# Altium schematic sheet LDR controlled LED.SchDoc
size A; SheetNumber: 1; SheetTotal: 1
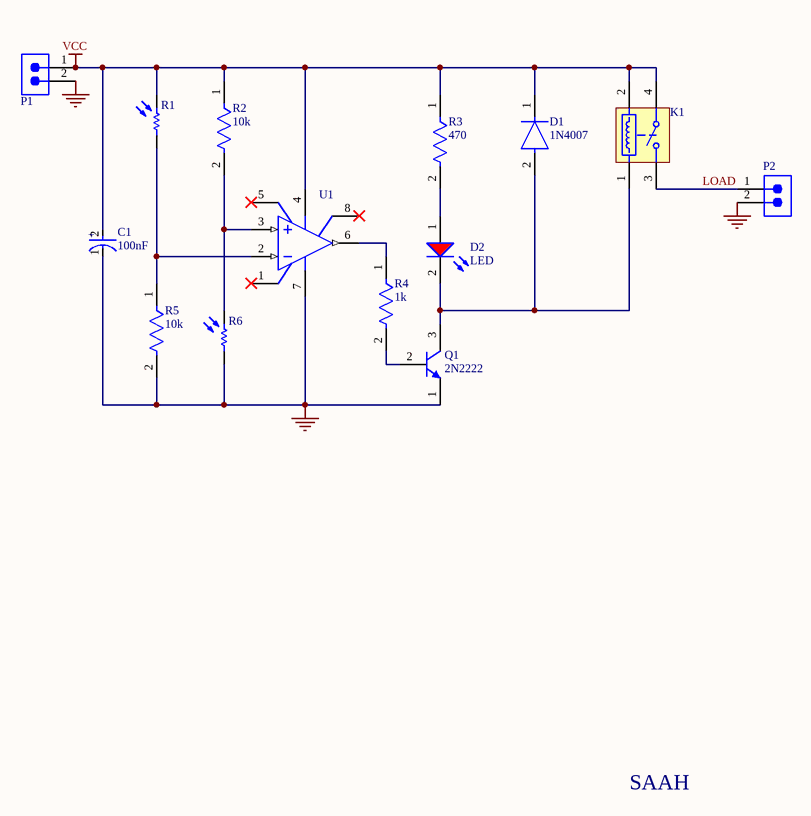
[diagram p0: LDR controlled LED.SchDoc]

## Parts
C1  100nF  [FP-RAD-TH-D_12_5_0_5-L_20-MFG]
D1  1N4007  [FP-1N4007-MFG]
D2  LED  [WL-TMRC_D5.9H8.7]
K1  ALFG1PF09  [PNSC-LF-G-4-3010x1570x2330_V]  (value not drawn)
P1  653102124022  [653102124022]  (value not drawn)
P2  653102124022  [653102124022]  (value not drawn)
Q1  2N2222  [MLTC-TO-18-3]
R1  VT90N1  [EXCE-VT90N1]  (value not drawn)
R2  10k  [FP-CF14-MFG]
R3  470  [FP-CF14-MFG]
R4  1k  [FP-CF14-MFG]
R5  10k  [FP-CF14-MFG]
R6  VT90N1  [EXCE-VT90N1]  (value not drawn)
U1  LM741CN/NOPB  [P0008A]  (value not drawn)

## Nets
GND: C1.1(C) P1.2 P2.2 Q1.1(E) R5.2 R6.1 U1.7(V+)
VCC: C1.2(A) D1.1(C) K1.2 K1.4(COM) P1.1 R1.2 R2.1 R3.1 U1.4(V-)
LOAD: K1.3(NO) P2.1
NetD1_2: D1.2(A) D2.2(K) K1.1 Q1.3(C)
NetD2_1: D2.1(A) R3.2
NetQ1_2: Q1.2(B) R4.2
NetR1_1: R1.1 R5.1 U1.2(IN-)
NetR2_2: R2.2 R6.2 U1.3(IN+)
NetR4_1: R4.1 U1.6(OUT)

Not connected (* = marked no-connect by the designer): U1 1(OFS_NULL)* 5(OFS_NULL)* 8(NC)*

## Notes on the sheet
- SAAH
- (in symbol CMP-05427-000380-1) +

## Library data of the parts
C1 = CMP-05427-000380-1: Aluminum Electrolytic Capacitors (Radial Lead Type) 10uF ±20% 450V; Life (Hours): 10000Hour; Lead Diameter: 0.6mm; Leakage Current: 280uA; Dissipation Factor: 0.24%; Ripple Current: 490mA; Lead Pitch: 5mm; Packaging: Bulk; Min Operating Temperature: -25°C; Package Quantity: 200; Case/Package: Radial; Height - Seated (Max): 0.787inch; Max Operating Temperature: 105°C; Radiation Hardening: No; Lead Free: Lead Free; Series: EE; Capacitance: 10uF; Diameter: 12.5mm; Tolerance: 20%; Termination: Radial; RoHS Compliant: Yes; Voltage Rating: 450V; REACH SVHC: No SVHC; Voltage Rating (DC): 450V; Height: 20mm; Construction: RADIAL; Voltage: 450V; Length: 20mm; Mount: Through Hole
D1 = CMP-123542-000001-1: Rectifier diode 1000 V 1 A DO-41, ,; Manufacturer: Diotec; Max Surge Forward Current: 27A; Forward Current: 1A; Max Junction Temp: +175°C; Reverse Voltage: 1000V; Value: 15pF; Peak Reverse Current: 5uA; Category: Diode; Temperature Range Low: -50°C; Automotive: No; Temperature: -50°C to +175°C; Lead Free: Yes; ComponentLink2Description: Datasheet; Max Repetitive Reverse Voltage: 1000V; ComponentLink2URL: https://datasheet.octopart.com/1N4007-Diotec-datasheet-62346875.pdf; Manufacturer Part Number: 1N4007; Device Class L3: Rectifier Diodes; Height: 2.8mm; Octopart: https://octopart.com/1n4007-diotec-4040411; Package: 1N4007; Temperature Range High: +175°C; Device Class L1: Discrete Semiconductors; Device Class L2: Diodes; RoHS: TRUE; Capacitance: 15pF; Ipc Land Pattern Name: DIOAD888W100L520D280
D2 = CMP-03913-71241449-1: 151051SS04000 WL-TMRC THT Mono-color Round Color; Viewing Angle: 40°; Dominant Wavelength: 635nm; Forward Current: 100mA; Forward Voltage: 2.1V; Luminous Intensity: 250mcd; Max Reverse Voltage (DC): 5V; Peak Wavelength: 640nm; Height: 8.6mm; Packaging: Bulk; Mount: Through Hole; Width: 5mm; Min Operating Temperature: -40°C; Wavelength: 635nm; Max Operating Temperature: 85°C; RoHS: Compliant; Length: 5mm; NexarPartId: 71241449
K1 = CMP-1503-00183-1: LF-G Relays, 9 V Coil Voltage, 1400 mW Nominal Operating Power, -40 to 85 degC, 4-Pin LF-G, Carton, Case, RoHS; Manufacturer: Panasonic; Max Switching Current: 22 A AC; Mechanical Life(Min.operation): 1x10^6; Electrical Life: 3x10^4; Max Switching Voltage: 250 V AC; Coil Voltage: 9 V; Pb-Free: True; Nominal Operating Power: 1400 mW; ComponentLink2Description: Datasheet; ComponentLink1Description: Manufacturer URL; DatasheetVersion: 201402-T; PackageDescription: 4-Pin Through Hole Terminal Package, Body 30.1 x 15.7 mm; PackageVersion: ASCTB196E, 02/2014; ComponentLink3URL: http://www3.panasonic.biz/ac/e_download/control/relay/power/catalog/mech_eng_lfg.pdf?f_cd=300272; ComponentLink2URL: http://www3.panasonic.biz/ac/e_download/control/relay/power/catalog/mech_eng_lfg.pdf?f_cd=300272; ComponentLink1URL: http://www3.panasonic.biz/ac/ae/index.jsp; Packing: Carton, Case; RoHS: True; PackageReference: LF-G-4-3010x1570x2330; Series: LF-G Relays; PartNumber: ALFG1PF09; ComponentLink3Description: Package Specification; Mounting Technology: Through Hole
P1 P2 = CMP-1502-00757-2: NexarPartId: 18818273; Current Rating: 1A; Pitch: 1.25mm; Gender: Male; Connector Type: Male Pin; Insulation Resistance: 100MΩ; Contact Resistance: 20mΩ; Operating Supply Voltage: 125V; Number of Positions: 2; Insulation: Insulated; Number of Pins: 2; Flammability Rating: UL94 V-0; Number of Rows: 1; Termination: SMD/SMT; Width: 7.25mm; Contact Material: Copper; Color: Beige, White; Contact Gender: Male; Housing Material: Nylon; Contact Mating Length: 2.159mm; RoHS: Compliant; Orientation: Vertical; Min Operating Temperature: -40°C; Max Operating Temperature: 85°C; Voltage Rating: 125V; Height: 4.75mm; Packaging: Tape and Reel; Lead Pitch: 1.25mm; Mount: Surface Mount; REACH SVHC: Unknown; Contact Plating: Tin; Length: 7.25mm; Number of Contacts: 2
Q1 = CMP-2000-05237-1: Low Power Bipolar NPN Transistor, 30 V, -65 to 200 degC, 3-Pin TO-18, RoHS, Bulk; Manufacturer: Multicomp; Pin Configuration: a; No. of Pins: 3; No. of Transistors: 1; Collector Emitter Voltage Vces: 400mV; Current Ic Continuous a Max: 800mA; Power Dissipation Pd: 500mW; Collector Emitter Voltage V(br)ceo: 30V; Gain Bandwidth ft Typ: 250MHz; Voltage Vcbo: 60V; DC Current Gain hFE: 100; Full Power Rating Temperature: 25degC; Current Ic @ Vce Sat: 150mA; SVHC: NoSVHC(19-Dec-2012); Package Reference: TO-18-3; Package Description: 3-Pin Transistor Outline Package (TO-18), Dia 5.54 mm, Pitch Pitch 1.485mm; Datasheet URL: http://www.farnell.com/datasheets/1662272.pdf; Transistor Case Style: TO-18; Continuous Collector Current Ic Max: 800mA; Manufacturer URL: http://uk.farnell.com/b/multicomp; DC Collector Current: 800mA; Hfe Min: 100; Transistor Polarity: NPN; Power Dissipation Ptot Max: 500mW; Package / Case: TO-18; Datasheet Version: Rev. 1.1, 05/2012; Gain Bandwidth ft Min: 250MHz; Current Ic hFE: 150mA
R1 R6 = CMP-2000-07406-1: Photoconductive Resistor, 200 kOhm, 100 V, 80 mW, -40 to 75 degC, 2-Pin THD, RoHS; Manufacturer: Excelitas Technology; SVHC: Cadmiumchloride(15-Jun-2015); Power Rating: 80mW; Resistance @ Lux: 12kohm; Voltage Rating: 100V; Product Range: -; Datasheet Version: 09/2006; Resistor Case Style: -; Operating Temperature Max: 75°C; Package Reference: VT90N1; Datasheet URL: http://datasheet.octopart.com/VT90N1-Excelitas-datasheet-10388451.pdf; Mounting Technology: ThroughHole; Operating Temperature Min: -40°C; Dark Resistance: 200kohm; Package Description: 2-Pin Through Hole Device, Body Width 4.17 mm (Max), Height 2.29 mm; Manufacturer URL: http://www.excelitas.com/Pages/Index.aspx; Packaging: Each
R2-R5 = CMP-26528-000003-1: RES 7.5K OHM 1/4W 5% AXIAL; Max Power Dissipation: 250mW; Temperature Coefficient: -400ppm/°C; Resistance: 7.5kR; RoHS Compliant: Yes; Lead Free: Lead Free; Max Operating Temperature: 155°C; Case/Package: Axial; Tolerance: 5%; Power Rating: 250mW; Diameter: 2.3mm; Features: Flame Retardant Coating; Series: CF; Resistor Type: Carbon Film; Number of Terminations: 2; Length: 0.256inch; Min Operating Temperature: -55°C; Contact Plating: Tin; Packaging: Tape and Reel; Mount: Through Hole; Radiation Hardening: No
U1 = CMP-0055-00162-3: Operational Amplifier, 8-pin MDIP, Pb-Free; Manufacturer: Texas Instruments; PackageTopMarking: NSUZXYTTE#*LM*741CN; PowerWise: N; CompType: Amplifiers; ComponentLink1Description: Datasheet URL; ComponentLink1URL: http://www.ti.com/general/docs/lit/getliterature.tsp?genericPartNumber=LM741&fileType=pdf; PackageDescription: MDIP, .365 x .250 x .130in, 8 Lead, .100in Pitch; RoHS: Y; PinCount: 8; Code_JEDEC: MS-001-BA; Package Reference: P0008A